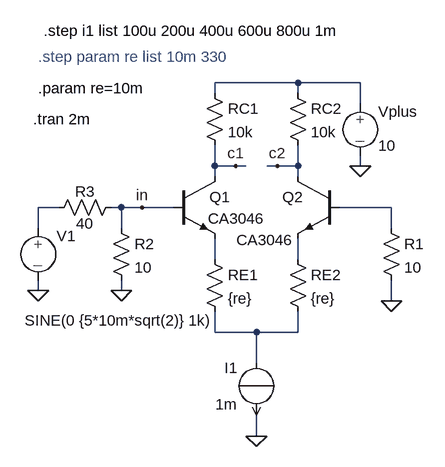
[diagram p0: schematic diff_a4-mult.asc]
diff_a4-mult.asc, the LTspice schematic file:
Version 4
SHEET 1 952 680
WIRE 432 -32 304 -32
WIRE 528 -32 432 -32
WIRE 304 -16 304 -32
WIRE 432 -16 432 -32
WIRE 528 0 528 -32
WIRE 304 96 304 64
WIRE 336 96 304 96
WIRE 352 96 336 96
WIRE 400 96 384 96
WIRE 432 96 432 64
WIRE 432 96 400 96
WIRE 528 96 528 80
WIRE 304 112 304 96
WIRE 432 112 432 96
WIRE 64 160 32 160
WIRE 160 160 144 160
WIRE 192 160 160 160
WIRE 240 160 192 160
WIRE 576 160 496 160
WIRE 32 192 32 160
WIRE 160 192 160 160
WIRE 576 192 576 160
WIRE 304 240 304 208
WIRE 432 240 432 208
WIRE 32 288 32 272
WIRE 160 288 160 272
WIRE 576 304 576 272
WIRE 304 352 304 320
WIRE 368 352 304 352
WIRE 432 352 432 320
WIRE 432 352 368 352
WIRE 368 400 368 352
WIRE 368 512 368 480
FLAG 576 304 0
FLAG 160 288 0
FLAG 32 288 0
FLAG 528 96 0
FLAG 336 96 c1
FLAG 400 96 c2
FLAG 192 160 in
FLAG 368 512 0
SYMBOL EIT_Semiconductors\\npn 240 112 R0
WINDOW 3 53 65 Left 2
SYMATTR Value CA3046
SYMATTR InstName Q1
SYMBOL EIT_Semiconductors\\npn 496 112 M0
WINDOW 3 72 98 Left 2
SYMATTR Value CA3046
SYMATTR InstName Q2
SYMBOL res 288 -32 R0
SYMATTR InstName RC1
SYMATTR Value 10k
SYMBOL res 416 -32 R0
SYMATTR InstName RC2
SYMATTR Value 10k
SYMBOL res 560 176 R0
SYMATTR InstName R1
SYMATTR Value 10
SYMBOL res 144 176 R0
SYMATTR InstName R2
SYMATTR Value 10
SYMBOL res 48 176 R270
WINDOW 0 25 56 VTop 2
WINDOW 3 7 56 VBottom 2
SYMATTR InstName R3
SYMATTR Value 40
SYMBOL source-V 32 176 R0
WINDOW 3 -21 158 Left 2
WINDOW 123 0 0 Left 2
WINDOW 39 0 0 Left 2
SYMATTR Value SINE(0 {5*10m*sqrt(2)} 1k)
SYMATTR InstName V1
SYMBOL source-V 528 -16 R0
SYMATTR InstName Vplus
SYMATTR Value 10
SYMBOL res 288 224 R0
SYMATTR InstName RE1
SYMATTR Value {re}
SYMBOL res 416 224 R0
SYMATTR InstName RE2
SYMATTR Value {re}
SYMBOL source-I 368 480 R180
WINDOW 0 29 73 Left 2
WINDOW 3 29 17 Left 2
SYMATTR InstName I1
SYMATTR Value 1m
TEXT 24 24 Left 2 !.tran 2m
TEXT 32 -24 Left 2 !.param re=10m
TEXT 32 -72 Left 2 ;.step param re list 10m 330
TEXT 40 -112 Left 2 !.step i1 list 100u 200u 400u 600u 800u 1m

The netlist it stands for:
* diff_a4-mult.asc
Q1 c1 in N004 0 CA3046
Q2 c2 N003 N005 0 CA3046
RC1 N001 c1 10k
RC2 N001 c2 10k
R1 N003 0 10
R2 in 0 10
R3 N002 in 40
V1 N002 0 SINE(0 {5*10m*sqrt(2)} 1k)
Vplus N001 0 10
RE1 N004 N006 {re}
RE2 N005 N006 {re}
I1 N006 0 1m
.model NPN NPN
.model PNP PNP
.lib standard.bjt
.tran 2m
.param re=10m
* .step param re list 10m 330
.step i1 list 100u 200u 400u 600u 800u 1m
.backanno
.end